# Altium schematic sheet Board-user.SchDoc: =ProjectTitle
size 297 x 209 mm; Address1: Address1; Address2: Address2; Address3: Address3; Address4: Address4; SheetNumber: 5; SheetTotal: 6; Scale: 1:1; DocumentType: Схема электрическая принципиальная
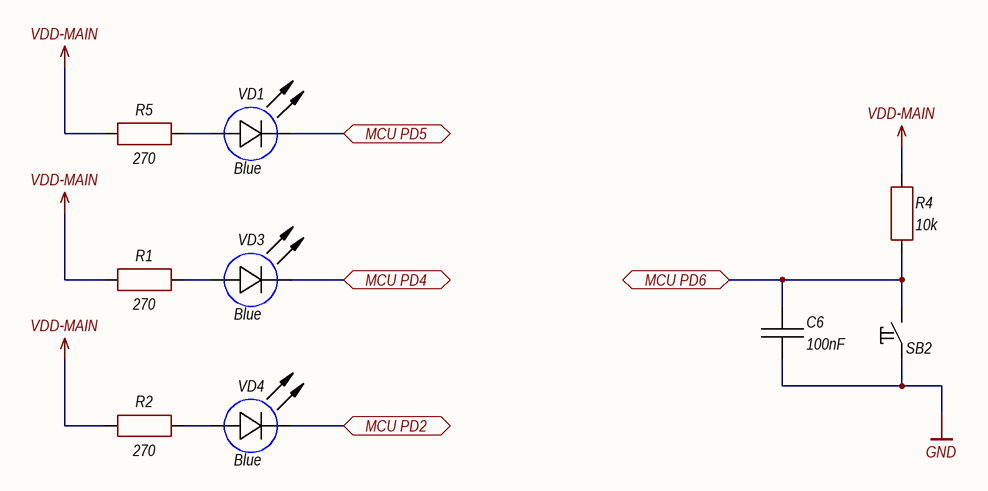
[diagram p0: Board-user.SchDoc]

## Parts
C6  100nF  [CH0402C]
R1  270  [CH0402R]
R2  270  [CH0402R]
R4  10k  [CH0402R]
R5  270  [CH0402R]
SB2  "Кнопка"  [BUT: YTS-A017]  (value not drawn)
VD1  Blue  [CH0402LB]
VD3  Blue  [CH0402LB]
VD4  Blue  [CH0402LB]

## Ports
MCU PD2 (bidir), MCU PD4 (bidir), MCU PD5 (bidir), MCU PD6 (bidir)

## Nets
GND: C6.1 SB2.1
VDD-MAIN: R1.1 R2.1 R4.1 R5.1
MCU PD2: VD4.2(C) ; port MCU PD2
MCU PD4: VD3.2(C) ; port MCU PD4
MCU PD5: VD1.2(C) ; port MCU PD5
MCU PD6: C6.2 R4.2 SB2.2 ; port MCU PD6
NetR1_2: R1.2 VD3.1(A)
NetR2_2: R2.2 VD4.1(A)
NetR5_2: R5.2 VD1.1(A)

## Notes on the sheet
- Изм.
- Лист
- № докум.
- Подп.
- Дата
- Копировал
- Формат А4

## Library data of the parts
C6 = Capacitor: Manufacturer: CCTC; Model: TCC0402X7R104K250AT; HelpURL: https://lcsc.com/product-detail/Multilayer-Ceramic-Capacitors-MLCC-SMD-SMT_CCTC-TCC0402X7R104K250AT_C466234.html; ComponentKind: X7R, 50V; Value: 100nF
R1 R2 R5 = Resistor: Manufacturer: YAGEO; Model: AC0402FR-07270RL; HelpURL: https://lcsc.com/product-detail/Chip-Resistor-Surface-Mount_YAGEO-AC0402FR-07270RL_C138294.html; ComponentKind: 0402 resistor; Value: 270
R4 = Resistor: Manufacturer: UNI-ROYAL(Uniroyal Elec); Model: 0402WGF1003TCE; HelpURL: https://lcsc.com/product-detail/Chip-Resistor-Surface-Mount_UNI-ROYAL-Uniroyal-Elec-0402WGF1003TCE_C25741.html; ComponentKind: 0402 resistor ±1%; Value: 10k
SB2 = Tactile switches: 6x6 mm; Manufacturer: DGBZ; Model: YTSA017A0252501B; HelpURL: https://lcsc.com/product-detail/Tactile-Switches_DGBZ-YTSA017A0252501B_C967796.html; ComponentKind: SMT Tactile switch
VD1 VD3 VD4 = LED: Manufacturer: XINGLIGHT; Model: XL-1005UBC; HelpURL: https://lcsc.com/product-detail/Pre-ordered-Products_XINGLIGHT-XL-1005UBC_C965795.html; ComponentKind: Blue led, 2.8V, 5mA; Value: Blue